# EAGLE design Precision Rectifier (EAGLE 5.11)
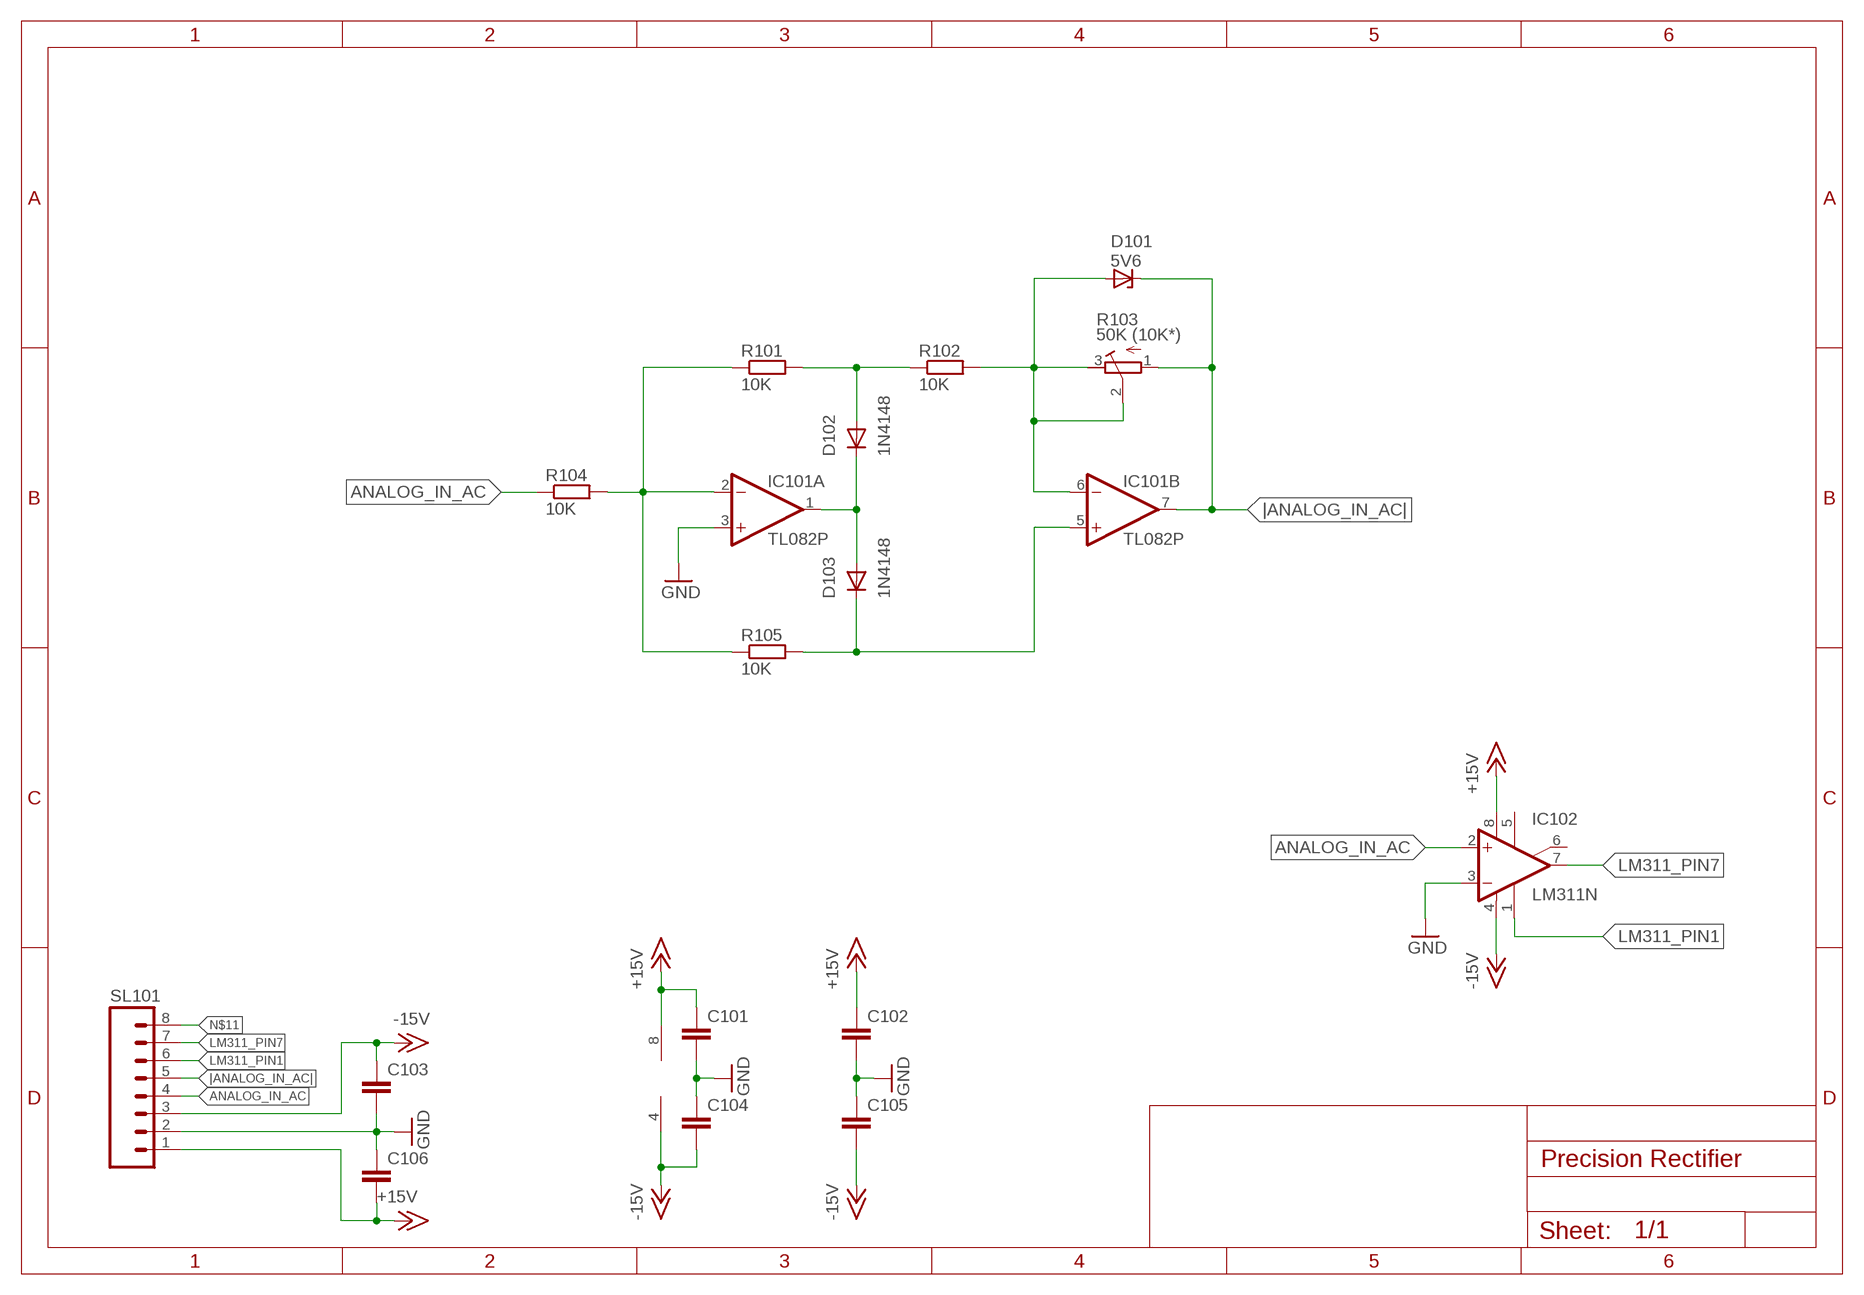
[diagram p0: schematic, sheet 1]

## Parts
C101  C-EU050-024X044  [C050-024X044]
C102  C-EU050-024X044  [C050-024X044]
C103  C-EU050-024X044  [C050-024X044]
C104  C-EU050-024X044  [C050-024X044]
C105  C-EU050-024X044  [C050-024X044]
C106  C-EU050-024X044  [C050-024X044]
D101  5V6  ZENER-DIODEZD-5  [ZDIO-5]
D102  1N4148  1N4148DO35-7  [DO35-7]
D103  1N4148  1N4148DO35-7  [DO35-7]
IC101  TL082P  [DIL08]
IC102  LM311N  [DIL08]
R101  10K  R-EU_0207/7  [0207/7]
R102  10K  R-EU_0207/7  [0207/7]
R103  50K (10K*)  R-TRIMM3296X  [RTRIM3296X]
R104  10K  R-EU_0207/7  [0207/7]
R105  10K  R-EU_0207/7  [0207/7]
SL101  M08  [08P]

## Nets
+15V: C101.1 C102.1 C106.2 IC101.8(P:V+) IC102.8(V+) SL101.1
-15V: C103.1 C104.2 C105.2 IC101.4(P:V-) IC102.4(V-) SL101.3
ANALOG_IN_AC: IC102.2(+IN) R104.1 SL101.4
GND: C101.2 C102.2 C103.2 C104.1 C105.1 C106.1 IC101.3(A:+IN) IC102.3(-IN) SL101.2
LM311_PIN1: IC102.1(GND) SL101.6
LM311_PIN7: IC102.7(OUT) SL101.7
N$2: IC101.2(A:-IN) R101.1 R104.2 R105.1
N$3: D102.C D103.A IC101.1(A:OUT)
N$4: D103.C IC101.5(B:+IN) R105.2
N$5: D101.A IC101.6(B:-IN) R102.2 R103.2(S) R103.3(A)
N$6: D102.A R101.2 R102.1
N$11: SL101.8
|ANALOG_IN_AC|: D101.C IC101.7(B:OUT) R103.1(E) SL101.5
Unconnected: IC102.5(ON) IC102.6(ON/STR)

## Library data of the parts
C101-C106 = rcl:C-EU: CAPACITOR, European symbol
D101 = diode:ZENER-DIODE: Z-Diode
D102 D103 = diode:1N4148: DIODE high speed (Philips)
IC101 = linear:TL082: OP AMP
IC102 = linear:LM311: COMPARATOR
R101 R102 R104 R105 = rcl:R-EU_: RESISTOR, European symbol
R103 = rcl:R-TRIMM: Trimm resistor
SL101 = con-amp-quick:M08: AMP QUICK CONNECTOR; OC_FARNELL: unknown; OC_NEWARK: unknown

## Board
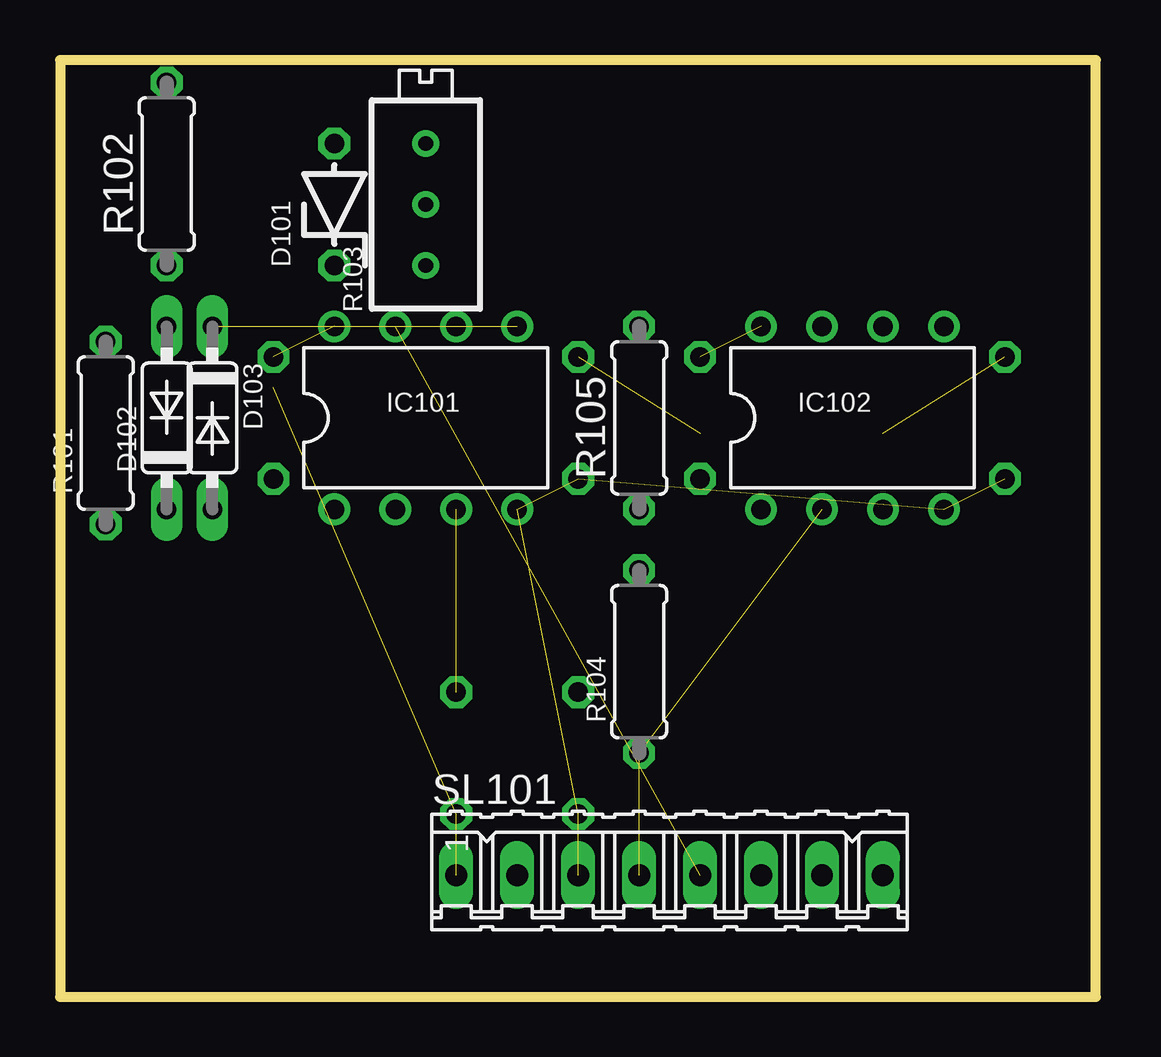
[diagram p1: board, top side]
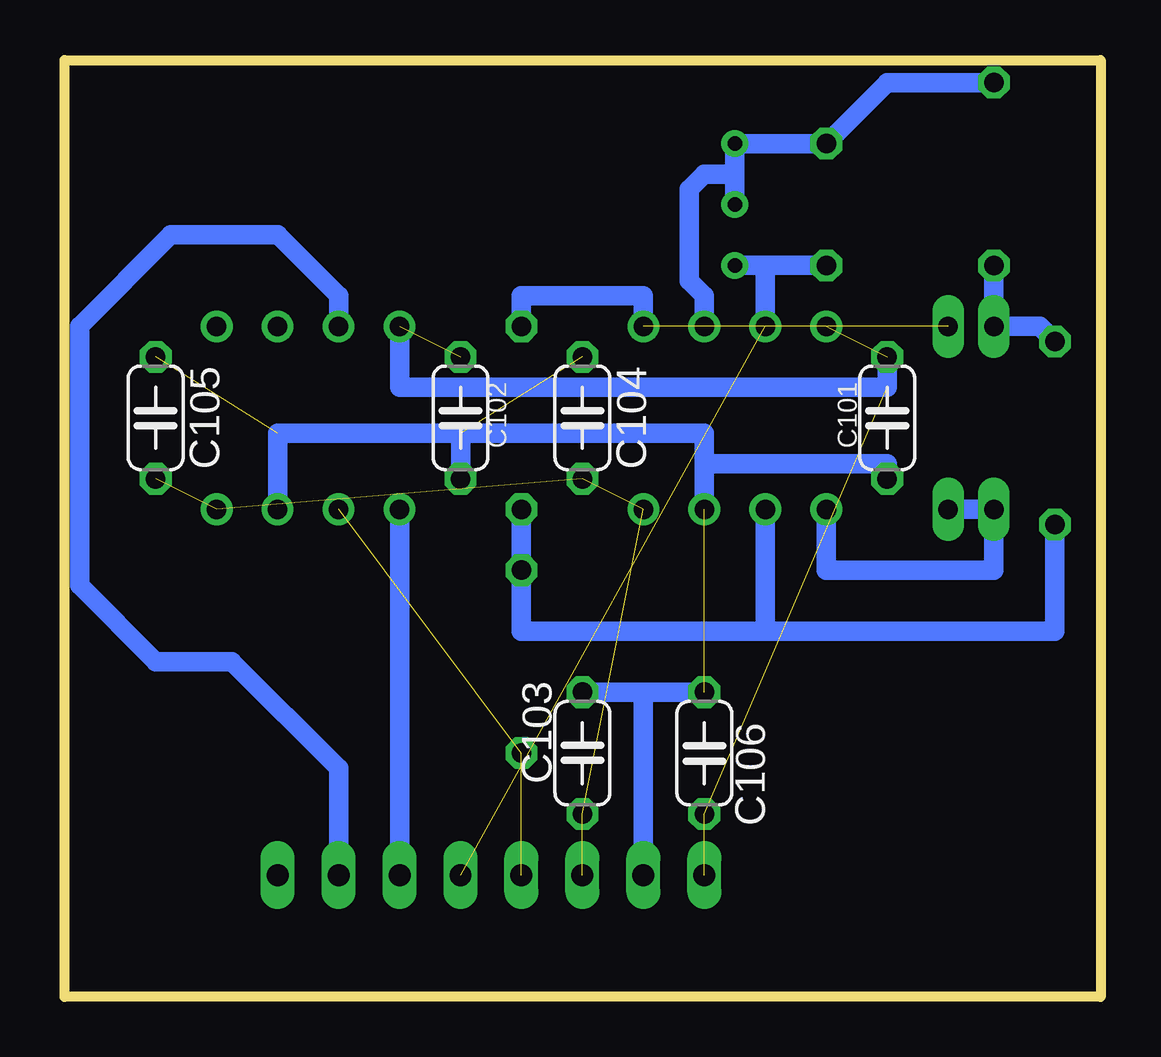
[diagram p2: board, bottom side, seen from below]

Size 43.16 x 39.04 mm. Coordinates in mm from the lower left corner, seen from the top.
Outline: 0,0 43.16,0 43.16,39.04 0,39.04 0,0
Copper layers (1*16): Top 0.035mm / dielectric 1.5mm / Bottom 0.035mm
Design rules "default": minimum track width 10mil, minimum drill 24mil, track to track 8mil, track to pad 8mil, pad to pad 8mil, via to via 8mil, smd to smd 8mil, copper to edge 40mil, drill to drill 8mil, minimum pad ring 10mil, minimum via ring 8mil, stop-mask expansion 4mil, vias tented up to drill 0mil, thermal gap 10mil

### Footprints (pad centres in the part's own frame; a part is rotated, then mirrored left to right if it is on the bottom)
C050-024X044 = drill 0.813 octagon: 1 -2.54,0; 2 2.54,0
ZDIO-5 = drill 0.813 octagon: A 2.54,0; C -2.54,0
DO35-7 = drill 0.813 long: A 3.81,0; C -3.81,0
DIL08 = drill 0.813 pad 1.27 round: 1 -3.81,-3.81; 2 -1.27,-3.81; 3 1.27,-3.81; 4 3.81,-3.81; 5 3.81,3.81; 6 1.27,3.81; 7 -1.27,3.81; 8 -3.81,3.81
0207/7 = drill 0.813 octagon: 1 -3.81,0; 2 3.81,0
RTRIM3296X = drill 0.61 round: 1 0,-2.54; 2 0,0; 3 0,2.54
08P = drill 0.914 long: 1 -8.89,0; 2 -6.35,0; 3 -3.81,0; 4 -1.27,0; 5 1.27,0; 6 3.81,0; 7 6.35,0; 8 8.89,0

### Placement (x,y rotation side)
C101  8.89,24.13 270 bottom
C102  26.67,24.13 270 bottom
C103  21.59,10.16 90 bottom
C104  21.59,24.13 270 bottom
C105  39.37,24.13 270 bottom
C106  16.51,10.16 270 bottom
D101  11.43,33.02 90 top
D102  4.45,24.13 90 top
D103  6.35,24.13 270 top
IC101  15.24,24.13 0 top
IC102  33.02,24.13 0 top
R101  1.91,23.5 90 top
R102  4.45,34.29 90 top
R103  15.24,33.02 0 top
R104  24.13,13.97 90 top
R105  24.13,24.13 90 top
SL101  25.4,5.08 0 top

### Tracks (layer width: path | path; a pad name or v marks a point on that pad's centre or on a via)
+15V  (4 unrouted)
  Bottom 0.813: IC102.8 29.21,25.4 8.89,25.4 C101.1
-15V  (5 unrouted)
ANALOG_IN_AC  (2 unrouted)
GND  (3 unrouted)
  Bottom 0.813: 16.51,22.23 IC101.3 | 16.51,22.23 8.89,22.23 C101.2 | SL101.2 19.05,12.7 C106.1 C103.2 | 16.51,22.23 16.51,23.5 26.67,23.5 | 26.67,23.5 34.29,23.5 IC102.3 | 26.67,23.5 C102.2
LM311_PIN1
  Bottom 0.813: SL101.6 IC102.1
LM311_PIN7
  Bottom 0.813: SL101.7 31.75,9.53 36.2,13.97 39.37,13.97 42.55,17.14 42.55,27.94 38.73,31.75 34.29,31.75 31.75,29.21 IC102.7
N$2
  Bottom 0.813: 13.97,15.24 1.91,15.24 R101.1 | R105.1 R104.2 24.13,15.24 13.97,15.24 | 13.97,15.24 IC101.2
N$3
  Bottom 0.813: D103.A D102.C 4.45,17.78 11.43,17.78 IC101.1
N$4  (1 unrouted)
  Bottom 0.813: R105.2 24.13,29.21 19.05,29.21 IC101.5
N$5
  Bottom 0.813: 15.24,34.29 R103.2 | 15.24,34.29 R103.3 D101.A 8.89,38.1 R102.2 | IC101.6 16.51,29.21 17.14,29.84 17.14,33.66 16.51,34.29 15.24,34.29
N$6
  Bottom 0.813: R102.1 D102.A 2.54,27.94 R101.2
|ANALOG_IN_AC|  (1 unrouted)
  Bottom 0.813: 13.97,30.48 D101.C | 13.97,30.48 R103.1 | IC101.7 13.97,30.48